# Altium schematic sheet MotorControlCircruit.SchDoc
size A4
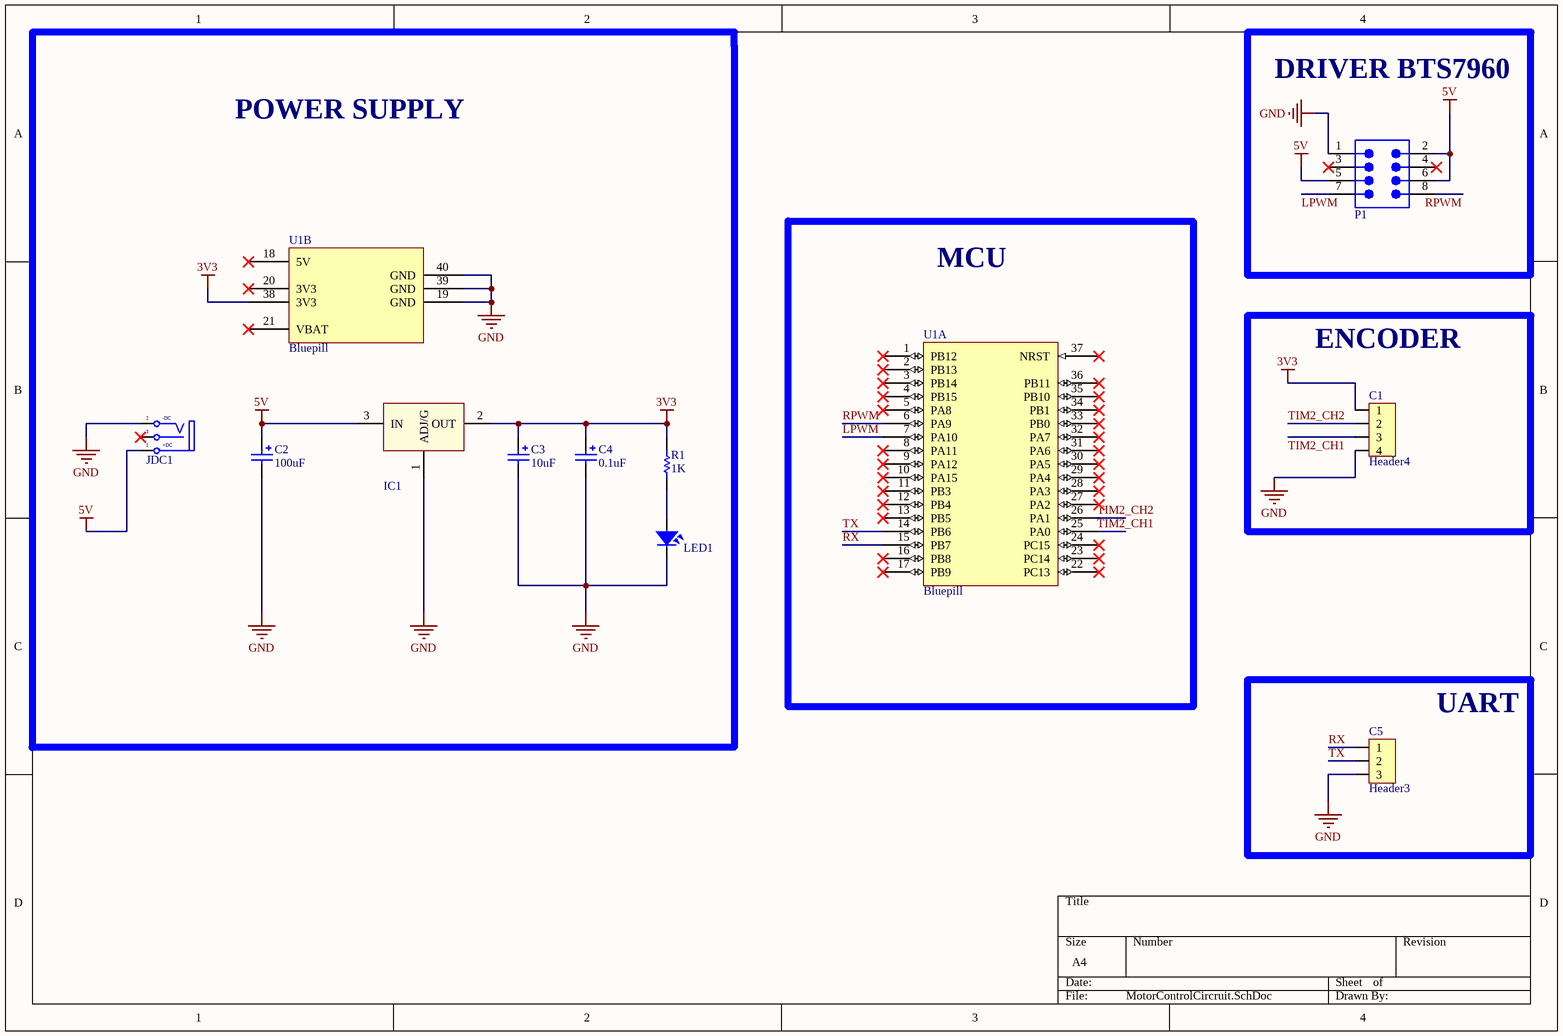
[diagram p0: MotorControlCircruit.SchDoc]

## Parts
C1  Header4  [Header4]
C2  value 100uF  [CP1.5/3.4]  (hidden comment: Cap Pol)
C3  value 10uF  [CP1/2.5]  (hidden comment: Cap Pol)
C4  value 0.1uF  [CP1/2.5]  (hidden comment: Cap Pol)
C5  Header3  [Header3]
IC1  LM1117  [QTO-220]  (value not drawn)
JDC1  Jack DC  [DC-IN]  (value not drawn)
LED1  LED  [LED-5-RED]  (value not drawn)
P1  61300821121  [61300821121]  (value not drawn)
R1  value 1K  [RES 1/4 W]  (hidden comment: RESISTOR)
U1  Bluepill  [Blue Pill]  (parts A,B of 2)

## Blocks framed on the sheet
POWER SUPPLY: C2-C4 IC1 JDC1 LED1 R1 U1
DRIVER BTS7960: P1
MCU: U1
ENCODER: C1
UART: C5

## Nets
3V3: C1.1 C3.1 C4.1 IC1.2(OUT) R1.2 U1.38(3V3)
5V: C2.1 IC1.3(IN) JDC1.1(T) P1.2 P1.5 P1.6
GND: C1.4 C2.2 C3.2 C4.2 C5.3 IC1.1(ADJ/G) JDC1.2(TN) LED1.2 P1.1 U1.19(GND) U1.39(GND) U1.40(GND)
LPWM: P1.7 U1.7(PA10)
RPWM: P1.8 U1.6(PA9)
RX: C5.1 U1.15(PB7)
TIM2_CH1: C1.3 U1.25(PA0)
TIM2_CH2: C1.2 U1.26(PA1)
TX: C5.2 U1.14(PB6)
NetLED1_1: LED1.1 R1.1

Not connected (* = marked no-connect by the designer): JDC1 3(S)*; P1 3* 4*; U1 1(PB12)* 2(PB13)* 3(PB14)* 4(PB15)* 5(PA8)* 8(PA11)* 9(PA12)* 10(PA15)* 11(PB3)* 12(PB4)* 13(PB5)* 16(PB8)* 17(PB9)* 18(5V)* 20(3V3)* 21(VBAT)* 22(PC13)* 23(PC14)* 24(PC15)* 27(PA2)* 28(PA3)* 29(PA4)* 30(PA5)* 31(PA6)* 32(PA7)* 33(PB0)* 34(PB1)* 35(PB10)* 36(PB11)* 37(NRST)*

## Notes on the sheet
- (in symbol Jack DC) -DC; +DC

## Library data of the parts
C1 = Header4: Header IDC, 4 x 1 Pin Vertical 2.54mm Pitch (Non-Boxed, Male); Manufacturer: W¨¹rth Elektronik eiSos GmbH; partNo: 613002143121; ComponentLink1 Description: Manufacturer; ComponentLink2 Description: Datasheet; NoPins: 02; Created Date: 29 March 2013; ComponentLink1URL: http://www.we-online.com; ComponentLink2URL: http://katalog.we-online.de/em/datasheet/6130xx143121.pdf; Created by: Karrer Zheng
C2-C4 = Cap Pol: Polarized Capacitor (Radial)
C5 = Header3: Header IDC, 3 x 1 Pin Vertical 2.54mm Pitch (Non-Boxed, Male); Manufacturer: W¨¹rth Elektronik eiSos GmbH; partNo: 613002143121; ComponentLink1 Description: Manufacturer; ComponentLink2 Description: Datasheet; NoPins: 02; Created Date: 29 March 2013; ComponentLink1URL: http://www.we-online.com; ComponentLink2URL: http://katalog.we-online.de/em/datasheet/6130xx143121.pdf; Created by: Karrer Zheng
IC1 = LM1117: Available in 1.8V, 2.5V, 2.85V, 3.3V, 5V, and  Adjustable Versions; Value: LM317
JDC1 = Jack DC: Jack DC input; Value: Jac DC
LED1 = LED: LED Single colour Green and Red; Value: LED 3 ly Single Colour
P1 = 61300821121: WR-PHD Pin Header, THT, Vertical, pitch 2.54mm, 2 Row, 8P; Manufacturer: Wurth Elektronik; Contact Resistance: 20mΩ; Rated Current: 3A; Working Voltage: 250V; Withstanding Voltage: 500V; ComponentLink1Description: Website Link; ComponentLink1URL: https://www.we-online.com/redexpert/article/61300821121?ad; ComponentLink2Description: Datasheet Link; ComponentLink2URL: https://www.we-online.com/redexpert/spec/61300821121?ad; Manufacturer Part Number: 61300821121; Category: Board-to-Board Connectors; Match Code: WR-PHD; Mount: Through Hole; Operating Temperature Max: 105°C; Operating Temperature Min: -40°C; Packaging: Bag; Gender: Pin Header; Number of Pins: 8; Number of Rows: 2; Orientation: Vertical; Pitch: 2.54mm
U1 = STM32F103C8T6